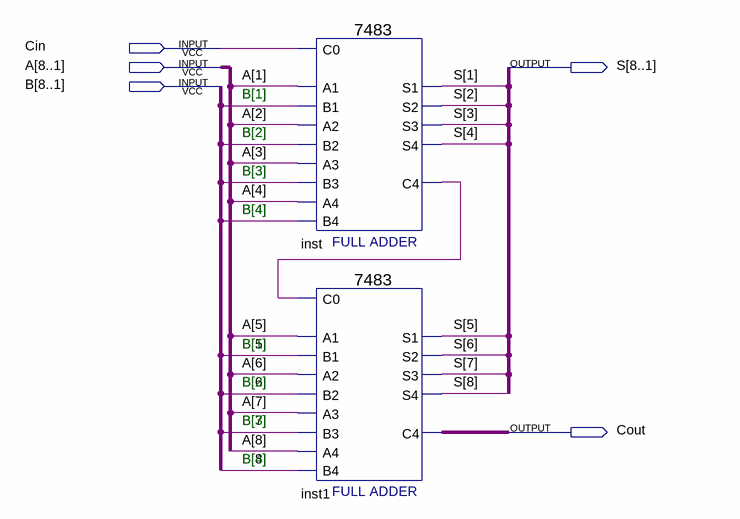
[diagram p0: schematic sheet]
// Quartus schematic summ8_sch.bdf as structural Verilog: 2 symbols, 5 pins
module summ8_sch (
  input  Cin,
  input  [8:1] A,
  input  [8:1] B,
  output [8:1] S,
  output Cout
);

  wire inst_c4;

  \7483  inst (
    .B4(B[4]), .C0(Cin), .A1(A[1]), .A2(A[2]), .B1(B[1]), .B2(B[2]), .A3(A[3]), .B3(B[3]), .A4(A[4]),
    .S3(S[3]), .S4(S[4]), .S2(S[2]), .C4(inst_c4), .S1(S[1]));
  \7483  inst1 (
    .B4(B[8]), .C0(inst_c4), .A1(A[5]), .A2(A[6]), .B1(B[5]), .B2(B[6]), .A3(A[7]), .B3(B[7]), .A4(A[8]),
    .S3(S[7]), .S4(S[8]), .S2(S[6]), .C4(Cout), .S1(S[5]));

  // Notes on the sheet:
  //   B[1]
  //   B[2]
  //   B[3]
  //   B[4]
  //   B[1]
  //   B[2]
  //   B[3]
  //   B[4]
endmodule
